# EAGLE design FrequencyGen (EAGLE 6.5.0)
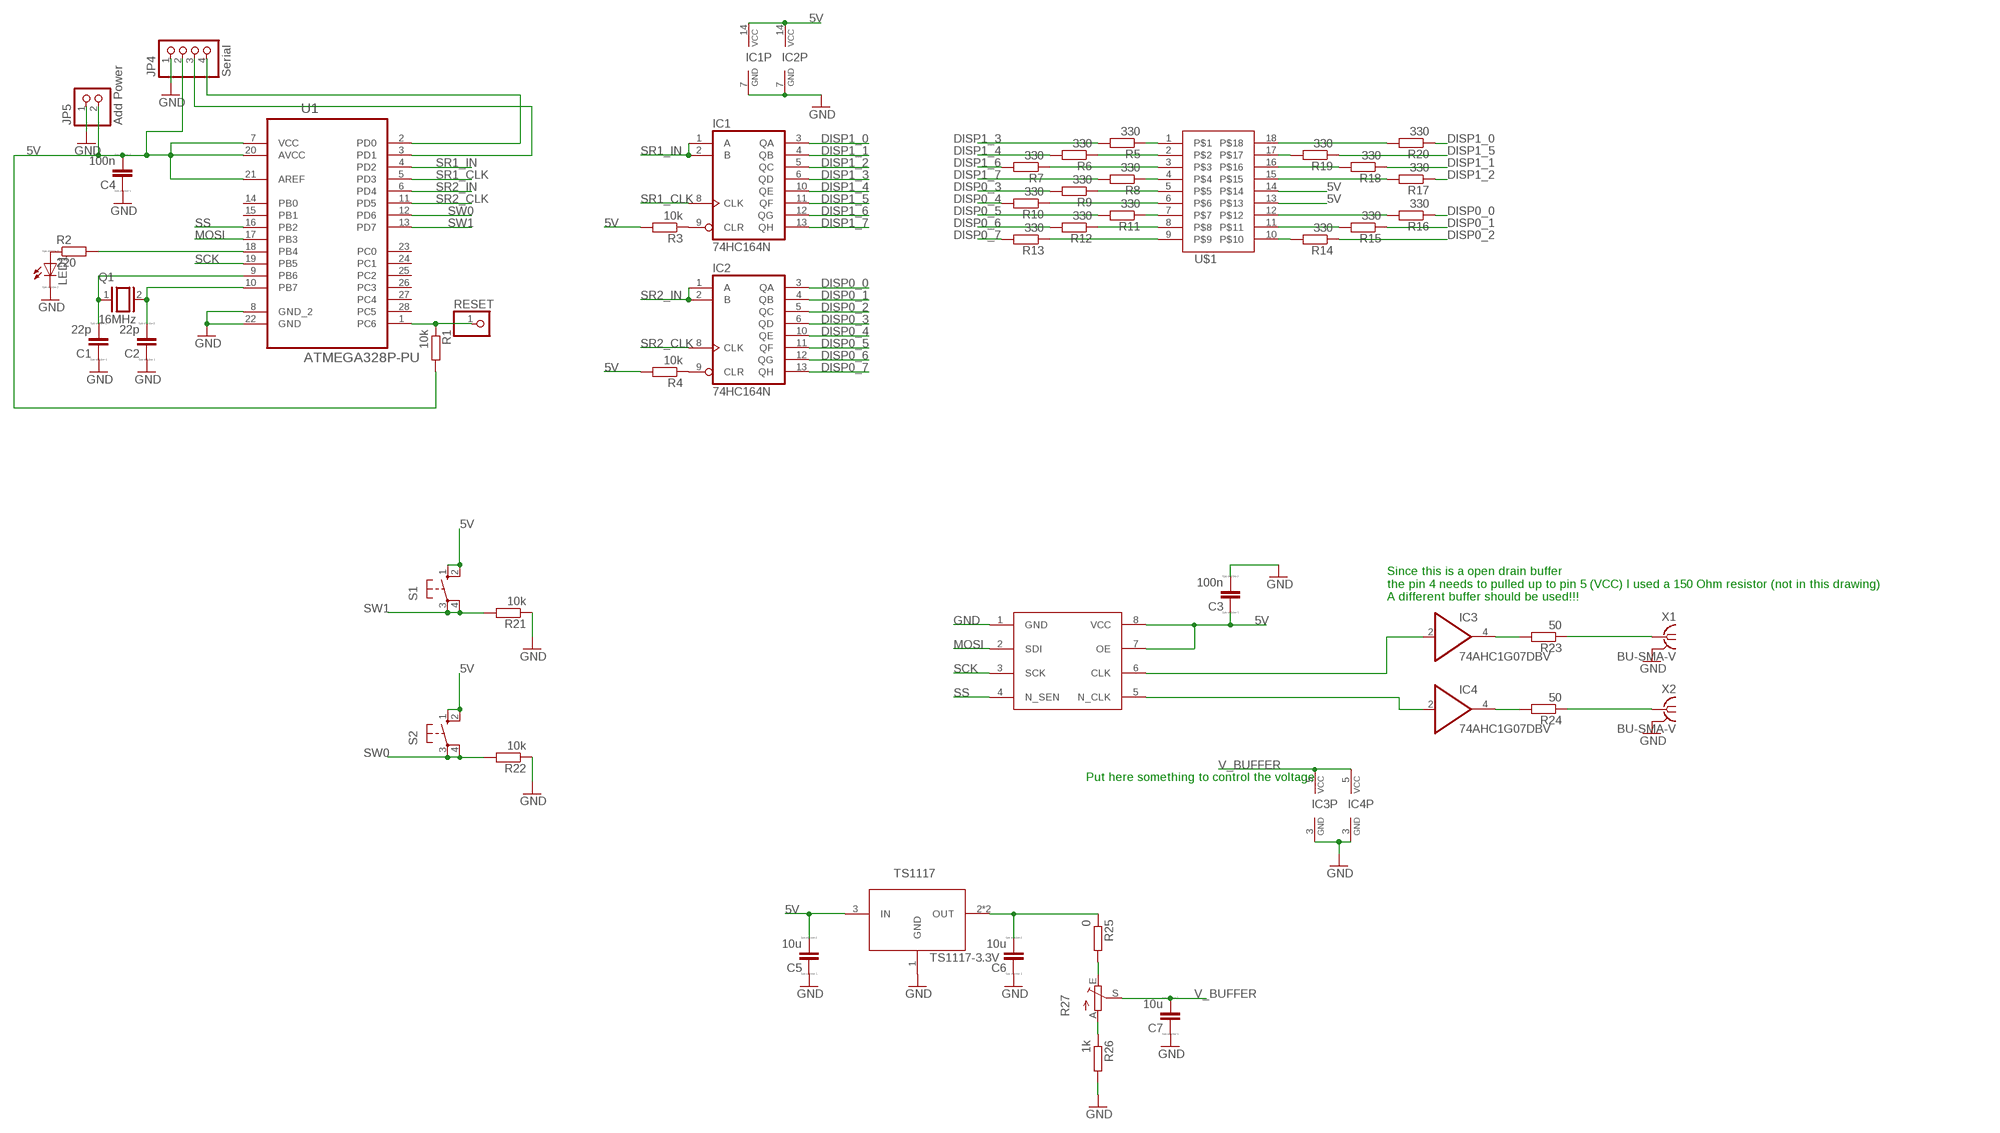
[diagram p0: schematic, sheet 1]

## Parts
C1  22p  C_SMD  [C0805]
C2  22p  C_SMD  [C0805]
C3  100n  C_SMD  [C0805]
C4  100n  C_SMD  [C0805]
C5  10u  C_SMD  [C0805]
C6  10u  C_SMD  [C0805]
C7  10u  C_SMD  [C0805]
IC1  74HC164N  [DIL14]
IC2  74HC164N  [DIL14]
IC3  74AHC1G07DBV  [SOT23-5]
IC4  74AHC1G07DBV  [SOT23-5]
JP4  Serial  PINHD-1X4  [1X04]
JP5  Add Power  PINHD-1X2  [1X02]
LED1  LED_ELD260  [LED_LD260]
Q1  16MHz  XTAL/S  [QS]
R1  10k  R-EU_R0805  [R0805]
R2  220  R-EU_R0805  [R0805]
R3  10k  R-EU_R0805  [R0805]
R4  10k  R-EU_R0805  [R0805]
R5  330  R-EU_R0805  [R0805]
R6  330  R-EU_R0805  [R0805]
R7  330  R-EU_R0805  [R0805]
R8  330  R-EU_R0805  [R0805]
R9  330  R-EU_R0805  [R0805]
R10  330  R-EU_R0805  [R0805]
R11  330  R-EU_R0805  [R0805]
R12  330  R-EU_R0805  [R0805]
R13  330  R-EU_R0805  [R0805]
R14  330  R-EU_R0805  [R0805]
R15  330  R-EU_R0805  [R0805]
R16  330  R-EU_R0805  [R0805]
R17  330  R-EU_R0805  [R0805]
R18  330  R-EU_R0805  [R0805]
R19  330  R-EU_R0805  [R0805]
R20  330  R-EU_R0805  [R0805]
R21  10k  R-EU_R0805  [R0805]
R22  10k  R-EU_R0805  [R0805]
R23  50  R-EU_R0805  [R0805]
R24  50  R-EU_R0805  [R0805]
R25  0  R-EU_R0805  [R0805]
R26  1k  R-EU_R0805  [R0805]
R27  TRIM_EU-CA6V  [CA6V]
RESET  PINHD-1X1  [1X01]
S1  10-XX  [B3F-10XX]
S2  10-XX  [B3F-10XX]
U1  ATMEGA328P-PU  [DIP254P762X457-28]
U$1  SEG_DISP_2X8  [DIL18-6]
U$2  LTC6903  [MSOP8]
U$3  TS1117-3.3V  TS1117  [SOT223]
X1  BU-SMA-V  [BU-SMA-V]
X2  BU-SMA-V  [BU-SMA-V]

## Nets
5V: C3.1 C4.2 C5.2 IC1.14(VCC) IC2.14(VCC) JP4.2 JP5.2 R1.2 R3.2 R4.2 S1.1(S) S1.2(S1) S2.1(S) S2.2(S1) U1.7(VCC) U1.20(AVCC) U1.21(AREF) U$1.13 U$1.14 U$2.7(OE) U$2.8(VCC) U$3.3(IN)
DISP0_0: IC2.3(QA) R16.1
DISP0_1: IC2.4(QB) R15.1
DISP0_2: IC2.5(QC) R14.1
DISP0_3: IC2.6(QD) R9.2
DISP0_4: IC2.10(QE) R10.2
DISP0_5: IC2.11(QF) R11.2
DISP0_6: IC2.12(QG) R12.2
DISP0_7: IC2.13(QH) R13.2
DISP1_0: IC1.3(QA) R20.1
DISP1_1: IC1.4(QB) R18.1
DISP1_2: IC1.5(QC) R17.1
DISP1_3: IC1.6(QD) R5.2
DISP1_4: IC1.10(QE) R6.2
DISP1_5: IC1.11(QF) R19.1
DISP1_6: IC1.12(QG) R7.2
DISP1_7: IC1.13(QH) R8.2
GND: C1.1 C2.1 C3.2 C4.1 C5.1 C6.1 C7.1 IC1.7(GND) IC2.7(GND) IC3.3(GND) IC4.3(GND) JP4.1 JP5.1 LED1.K(C) R21.1 R22.1 R26.2 U1.8(GND_2) U1.22(GND) U$2.1(GND) U$3.1(GND) X1.2 X1.3 X1.4 X1.5 X2.2 X2.3 X2.4 X2.5
MOSI: U1.17(PB3) U$2.2(SDI)
N$1: LED1.A R2.1
N$2: IC1.9(CLR) R3.1
N$3: IC2.9(CLR) R4.1
N$4: R5.1 U$1.1
N$5: R1.1 RESET.1 U1.1(PC6)
N$6: C1.2 Q1.1 U1.9(PB6)
N$7: C2.2 Q1.2 U1.10(PB7)
N$8: R6.1 U$1.2
N$9: R7.1 U$1.3
N$10: R8.1 U$1.4
N$11: R9.1 U$1.5
N$12: R10.1 U$1.6
N$13: R11.1 U$1.7
N$14: R12.1 U$1.8
N$15: R13.1 U$1.9
N$16: R20.2 U$1.18
N$17: R19.2 U$1.17
N$18: R18.2 U$1.16
N$19: R17.2 U$1.15
N$20: R16.2 U$1.12
N$21: R15.2 U$1.11
N$22: R14.2 U$1.10
N$23: R2.2 U1.18(PB4)
N$26: JP4.3 U1.3(PD1)
N$27: JP4.4 U1.2(PD0)
N$28: IC3.4(O) R23.2
N$29: IC4.4(O) R24.2
N$30: R23.1 X1.1
N$31: R24.1 X2.1
N$32: IC3.2(I) U$2.6(CLK)
N$33: IC4.2(I) U$2.5(N_CLK)
N$38: R25.2 R27.E
N$39: C6.2 R25.1 U$3.2(OUT) U$3.4(OUT)
N$40: R26.1 R27.A
SCK: U1.19(PB5) U$2.3(SCK)
SR1_CLK: IC1.8(CLK) U1.5(PD3)
SR1_IN: IC1.1(A) IC1.2(B) U1.4(PD2)
SR2_CLK: IC2.8(CLK) U1.11(PD5)
SR2_IN: IC2.1(A) IC2.2(B) U1.6(PD4)
SS: U1.16(PB2) U$2.4(N_SEN)
SW0: R22.2 S2.3(P) S2.4(P1) U1.12(PD6)
SW1: R21.2 S1.3(P) S1.4(P1) U1.13(PD7)
V_BUFFER: C7.2 IC3.5(VCC) IC4.5(VCC) R27.S
Unconnected: U1.14(PB0) U1.15(PB1) U1.23(PC0) U1.24(PC1) U1.25(PC2) U1.26(PC3) U1.27(PC4) U1.28(PC5)

## Notes on the sheet
- Since this is a open drain buffer
  the pin 4 needs to pulled up to pin 5 (VCC) I used a 150 Ohm resistor (not in this drawing)
  A different buffer should be used!!!
- Put here something to control the voltage

## Library data of the parts
C1-C7 = 0myLib:C_SMD: CAPACITOR, European symbol; SPICEMODEL: NONE; SPICEPREFIX: C
IC1 IC2 = 0myLib:74*164: 8-bit parallel out SHIFT REGISTER
IC3 IC4 = 0myLib:74*1G07: Single Buffer/Driver With Open-Drain Output
JP4 = 0myLib:PINHD-1X4: PIN HEADER
JP5 = 0myLib:PINHD-1X2: PIN HEADER
LED1 = 0myLib:LED_E: LED Source: http://www.osram.convergy.de Source: www.luxeon.com Source: www.kingbright.com; SPICEMODEL: NONE; SPICEPREFIX: D; SPICETYPE: diode
Q1 = 0myLib:XTAL/S: CRYSTAL
R1-R26 = 0myLib:R-EU_: RESISTOR, European symbol
R27 = 0myLib:TRIM_EU-: POTENTIOMETER
RESET = 0myLib:PINHD-1X1: PIN HEADER
S1 S2 = 0myLib:10-XX: OMRON SWITCH; MPN: B3F-1000; OC_FARNELL: 176432; OC_NEWARK: 36M3542
U1 = 0myLib:ATMEGA328P-PU: 8-bit Microcontroller with In-System Programmable Flash; MPN: ATMEGA328P-PU; OC_FARNELL: 1715487; OC_NEWARK: 15R0268; PACKAGE: PDIP-28; SUPPLIER: Atmel
U$1 = 0myLib:SEG_DISP_2X8
U$2 = 0myLib:LTC6903
U$3 = 0myLib:TS1117
X1 X2 = 0myLib:BU-SMA-V: FEMALE SMA CONNECTOR Radiall distributor RS 112-3794; OC_FARNELL: unknown; OC_NEWARK: unknown

## Board
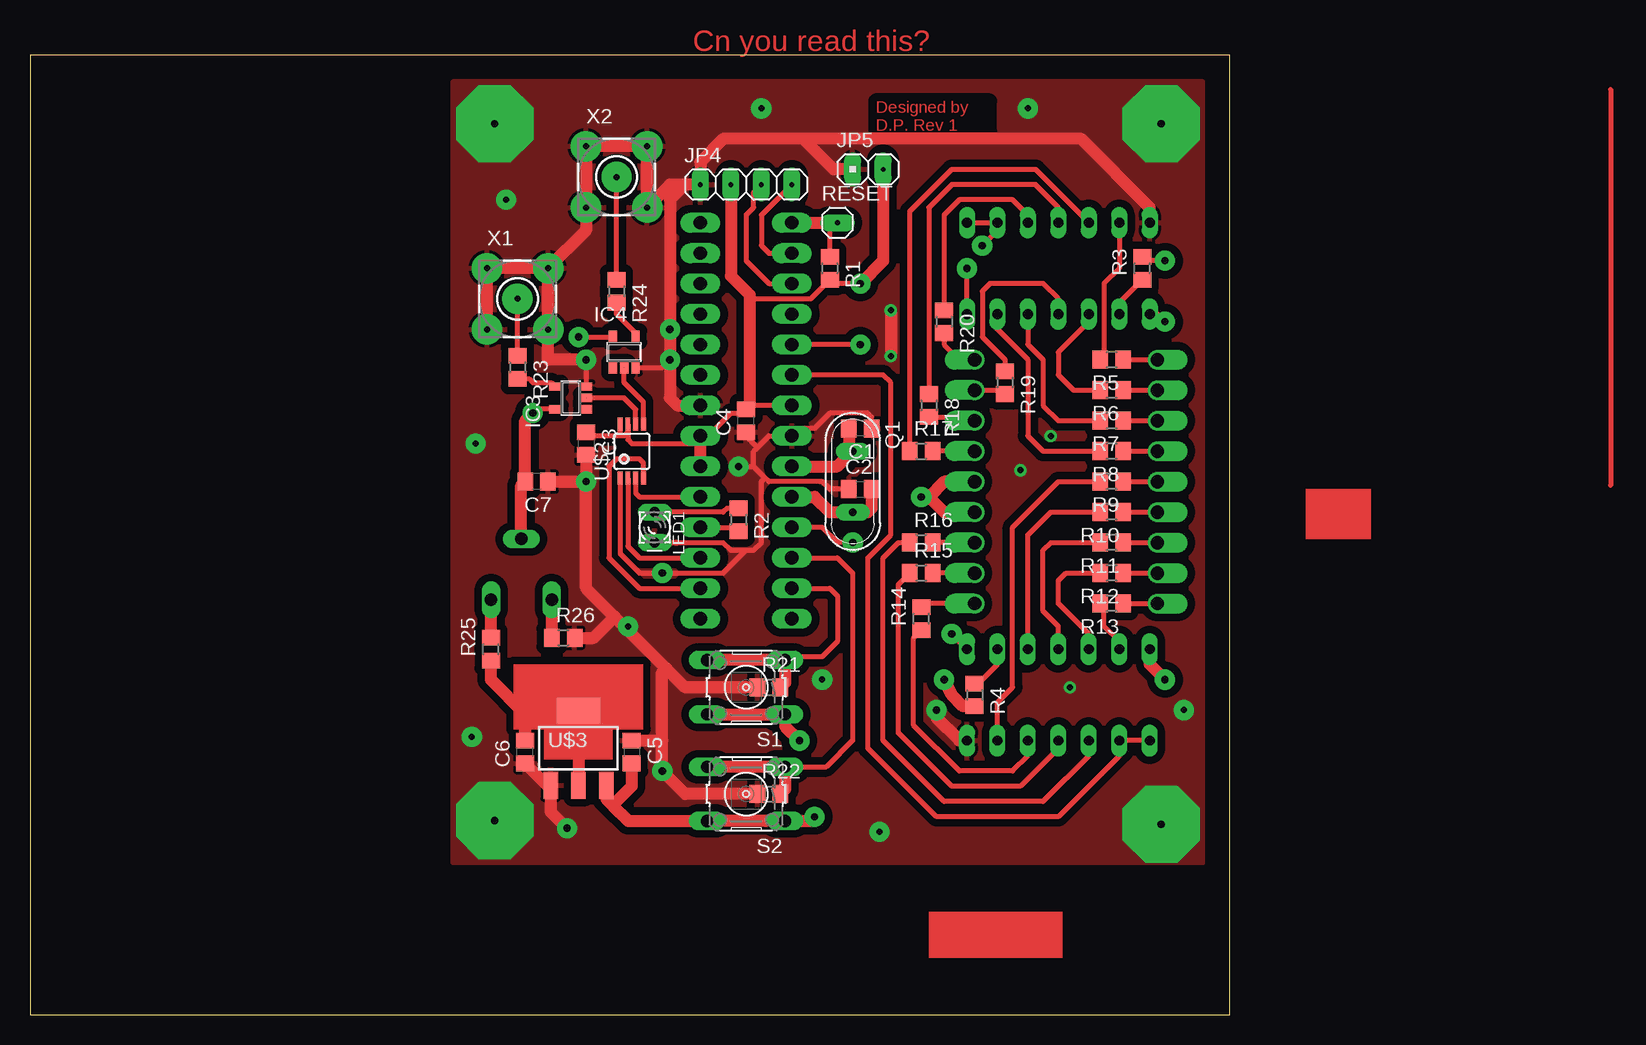
[diagram p1: board, top side]
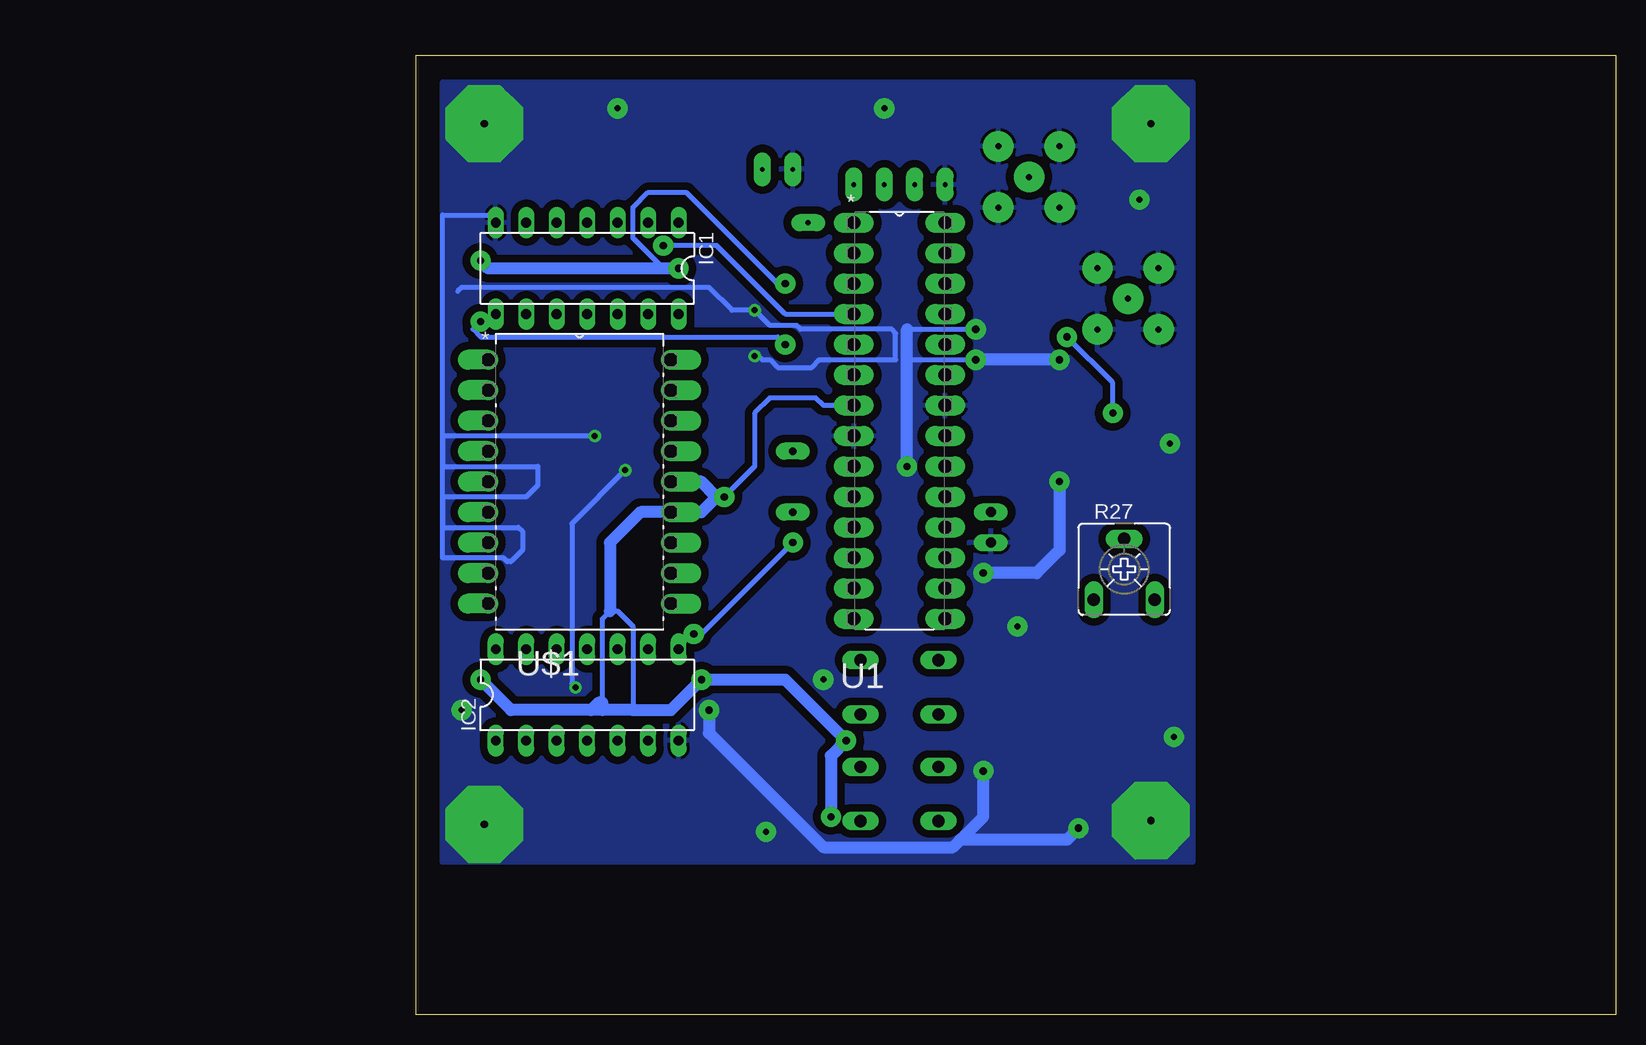
[diagram p2: board, bottom side, seen from below]

Size 100 x 80 mm. Coordinates in mm from the lower left corner, seen from the top.
Outline: 0,0 100,0 100,80 0,80 0,0
Copper layers (1*16): Top 0.035mm / dielectric 1.5mm / Bottom 0.035mm
Design rules "FinalizeAreaFill": minimum track width 12mil, minimum drill 1.4mm, track to track 25mil, track to pad 25mil, pad to pad 8mil, via to via 8mil, smd to smd 8mil, copper to edge 40mil, drill to drill 8mil, minimum pad ring 10mil, minimum via ring 8mil, stop-mask expansion 4mil, vias tented up to drill 0mil, thermal gap 10mil

### Footprints (pad centres in the part's own frame; a part is rotated, then mirrored left to right if it is on the bottom)
C0805 = smd 1.3 x 1.5: 1 -0.95,0; 2 0.95,0
DIL14 = drill 0.813 long: 1 -7.62,-3.81; 2 -5.08,-3.81; 3 -2.54,-3.81; 4 0,-3.81; 5 2.54,-3.81; 6 5.08,-3.81; 7 7.62,-3.81; 8 7.62,3.81; 9 5.08,3.81; 10 2.54,3.81; 11 0,3.81; 12 -2.54,3.81; 13 -5.08,3.81; 14 -7.62,3.81
SOT23-5 = smd 0.69 x 0.99: 1 -0.95,-1.29; 2 0,-1.29; 3 0.95,-1.29; 4 0.95,1.3; 5 -0.95,1.3
1X04 = drill 0.4 pad 1.422 long: 1 -3.81,0; 2 -1.27,0; 3 1.27,0; 4 3.81,0
1X02 = drill 0.4 pad 1.422 long: 1 -1.27,0; 2 1.27,0
LED_LD260 = drill 0.813 pad 1.422 long: A -1.27,0; K 1.27,0
QS = drill 0.61 pad 1.422 long: 1 -2.54,0; 2 2.54,0
R0805 = smd 1.3 x 1.5: 1 -0.95,0; 2 0.95,0
CA6V = drill 1.016 long: A -2.54,-2.54; E 2.54,-2.54; S 0,2.54
1X01 = drill 0.4 pad 1.422 long: 1 0,0
B3F-10XX = drill 1.016 long: 1 -3.251,2.261; 2 3.251,2.261; 3 -3.251,-2.261; 4 3.251,-2.261
DIP254P762X457-28 = drill 1.118 long: 1 -7.62,33.02; 2 -7.62,30.48; 3 -7.62,27.94; 4 -7.62,25.4; 5 -7.62,22.86; 6 -7.62,20.32; 7 -7.62,17.78; 8 -7.62,15.24; 9 -7.62,12.7; 10 -7.62,10.16; 11 -7.62,7.62; 12 -7.62,5.08; 13 -7.62,2.54; 14 -7.62,0; 15 0,0; 16 0,2.54; 17 0,5.08; 18 0,7.62; 19 0,10.16; 20 0,12.7; 21 0,15.24; 22 0,17.78; 23 0,20.32; 24 0,22.86; 25 0,25.4; 26 0,27.94; 27 0,30.48; 28 0,33.02
DIL18-6 = drill 1.118 offset: 1 -7.62,10.16; 2 -7.62,7.62; 3 -7.62,5.08; 4 -7.62,2.54; 5 -7.62,0; 6 -7.62,-2.54; 7 -7.62,-5.08; 8 -7.62,-7.62; 9 -7.62,-10.16; 10 7.62,-10.16; 11 7.62,-7.62; 12 7.62,-5.08; 13 7.62,-2.54; 14 7.62,0; 15 7.62,2.54; 16 7.62,5.08; 17 7.62,7.62; 18 7.62,10.16
MSOP8 = smd 0.4 x 1.1: 1 -0.975,-2.25; 2 -0.325,-2.25; 3 0.325,-2.25; 4 0.975,-2.25; 5 0.975,2.25; 6 0.325,2.25; 7 -0.325,2.25; 8 -0.975,2.25
SOT223 = smd 1.219 x 2.235: 1 -2.311,-3.099; 2 0,-3.099; 3 2.311,-3.099 | smd 3.6 x 2.2: 4 0,3.099
BU-SMA-V = drill 0.5 pad 2.54: 1 0,0; 2 -2.55,2.55; 3 2.55,2.55; 4 2.55,-2.55; 5 -2.55,-2.55

### Placement (x,y rotation side)
C1  69.22,48.9 180 top
C2  69.22,43.81 0 top
C3  46.35,47.62 270 top
C4  59.69,49.53 90 top
C5  50.16,21.91 270 top
C6  41.27,21.91 90 top
C7  42.23,44.45 180 top
IC1  85.72,62.23 180 bottom
IC2  85.72,26.67 0 bottom
IC3  45.09,51.44 90 top
IC4  49.53,55.24 0 top
JP4  59.69,69.22 0 top
JP5  69.85,70.48 0 top
LED1  52.07,40.64 270 top
Q1  68.58,44.45 270 top
R1  66.67,62.23 270 top
R2  59.05,41.27 270 top
R3  92.71,62.23 90 top
R4  78.74,26.67 270 top
R5  90.17,54.61 180 top
R6  90.17,52.07 180 top
R7  90.17,49.53 180 top
R8  90.17,46.99 180 top
R9  90.17,44.45 180 top
R10  90.17,41.91 180 top
R11  90.17,39.37 180 top
R12  90.17,36.83 180 top
R13  90.17,34.29 180 top
R14  74.3,33.02 90 top
R15  74.3,36.83 0 top
R16  74.3,39.37 0 top
R17  74.3,46.99 0 top
R18  74.93,50.8 270 top
R19  81.28,52.7 270 top
R20  76.2,57.78 270 top
R21  61.59,27.3 0 top
R22  61.59,18.41 0 top
R23  40.64,53.98 270 top
R24  48.9,60.33 270 top
R25  38.42,30.48 90 top
R26  44.45,31.43 0 top
R27  40.96,37.15 0 bottom
RESET  67.31,66.04 0 top
S1  59.69,27.3 180 top
S2  59.69,18.41 180 top
U1  55.88,33.02 0 bottom
U$1  86.36,44.45 0 bottom
U$2  50.16,46.99 0 top
U$3  45.72,22.23 0 top
X1  40.64,59.69 0 top
X2  48.9,69.85 0 top

### Tracks (layer width: path | path; a pad name or v marks a point on that pad's centre or on a via)
5V  (via drill 0.6 pad 1.68)
  Top 0.406: IC1.14 v78.11,62.23 | v94.61,62.87 93.03,62.87 R3.2 | 59.69,60.33 60.01,60.01 60.33,59.69 65.08,59.69 R1.2 67,60.96 v69.22,60.96 | U1.7 60.01,50.8 C4.2 59.38,50.16 58.42,50.16 56.52,48.26 U1.21 55.24,47.62 50.16,47.62 49.84,47.95 49.84,48.57 | U$2.8 49.19,48.55 48.9,48.26 | 48.9,48.26 46.67,48.26 C3.1 | U$2.7 49.84,48.57 | 49.84,48.57 49.53,48.26 48.9,48.26
  Top 1.016: IC2.14 93.34,29.21 v94.61,27.94 | JP4.2 58.42,61.59 59.69,60.33 | 60.01,50.8 60.01,60.01 | U1.20 U1.21 | v74.3,43.18 74.93,43.18 | 74.93,43.18 76.2,41.91 U$1.13 | U$1.14 76.2,44.45 74.93,43.18 | S2.1 S2.2 49.89,16.15 48.58,17.46 | S1.2 S1.1 62.94,24.05 v64.14,22.86 | S2.1 61.32,16.15 | S2.1 65.05,16.15 v65.41,16.51 | R4.2 77.78,25.72 76.83,26.67 v76.2,27.94 | U$3.3 48.03,18.01 48.58,17.46 | C5.2 50.16,19.05 48.58,17.46 | JP5.2 71.12,62.87 v69.22,60.96
  Bottom 0.406: 84.45,25.4 84.45,26.04 84.45,33.02 83.82,33.66 83.19,33.66 81.92,32.38 81.92,25.4 | U1.7 66.04,50.8 66.67,51.44 70.48,51.44 71.75,50.16 71.75,45.72 v74.3,43.18 | v78.11,62.23 79.38,62.23 81.92,64.77 81.92,67.31 80.64,68.58 77.47,68.58 69.85,60.96 v69.22,60.96
  Bottom 1.016: v78.11,62.23 93.98,62.23 v94.61,62.87 | 85.41,25.4 84.45,25.4 81.92,25.4 78.74,25.4 v76.2,27.94 69.22,27.94 v64.14,22.86 65.41,21.59 v65.41,16.51 | 85.41,25.4 92.08,25.4 v94.61,27.94 | 74.93,43.18 76.2,44.45 U$1.14 | 74.93,43.18 76.2,41.91 U$1.13 81.28,41.91 83.82,39.37 83.82,33.66 | 74.93,43.18 v74.3,43.18 | 84.45,26.04 84.77,26.04 85.41,25.4
DISP0_0
  Top 0.406: IC2.3 88.27,21.59 84.45,17.78 76.2,17.78 71.12,22.86 71.12,38.1 72.39,39.37 R16.1
DISP0_1
  Top 0.406: IC2.4 85.72,22.23 82.55,19.05 76.83,19.05 72.39,23.5 72.39,35.88 R15.1
DISP0_2
  Top 0.406: IC2.5 83.19,21.59 81.92,20.32 77.47,20.32 73.66,24.13 73.66,31.43 R14.1
DISP0_3
  Top 0.406: IC2.6 80.64,26.04 81.92,27.3 81.92,40.64 85.72,44.45 R9.2
DISP0_4
  Top 0.406: IC2.10 83.19,40.01 85.09,41.91 R10.2
DISP0_5
  Top 0.406: IC2.11 85.72,32.38 84.45,33.66 84.45,38.73 85.09,39.37 R11.2
DISP0_6
  Top 0.406: IC2.12 88.27,31.75 85.72,34.29 85.72,36.2 86.36,36.83 R12.2
DISP0_7
  Top 0.406: IC2.13 90.81,31.11 89.53,32.38 89.53,33.98 R13.2
DISP1_0
  Top 0.406: IC1.3 83.19,66.67 81.92,67.94 77.47,67.94 76.2,66.67 R20.1
DISP1_1
  Top 0.406: IC1.4 85.72,67.31 83.82,69.22 76.83,69.22 74.93,67.31 R18.1
DISP1_2
  Top 0.406: R17.1 73.34,67 76.83,70.48 83.82,70.48 IC1.5
DISP1_3
  Top 0.406: IC1.6 90.81,62.23 89.53,60.96 89.53,54.92 R5.2
DISP1_4
  Top 0.406: IC1.10 88.27,57.78 85.72,55.24 85.72,53.34 87,52.07 R6.2
DISP1_5
  Top 0.406: IC1.11 85.72,59.69 84.45,60.96 80.01,60.96 79.38,60.33 79.38,56.52 81.28,54.61 R19.1
DISP1_6
  Top 0.406: IC1.12 83.19,55.88 84.45,54.61 84.45,50.8 85.72,49.53 R7.2
DISP1_7
  Top 0.406: IC1.13 80.64,57.15 83.19,54.61 83.19,48.26 84.45,46.99 R8.2
GND  (via drill 0.5 pad 1.02, 0.5 pad 1.68, 0.6 pad 1.68, 0.6 pad 6.45)
  Top 0.406: C2.1 66.67,43.81 66.04,44.45 61.59,44.45 61.28,44.77 | 61.28,44.77 60.33,45.72 | C1.1 70.17,49.85 69.85,50.16 66.67,50.16 65.41,48.9 64.14,48.9 U1.8 61.59,48.26 60.64,47.31 | 60.33,45.72 60.33,46.99 60.64,47.31 | v59.05,45.72 60.33,45.72 | C4.1 59.69,48.26 60.64,47.31 | LED1.K 57.78,39.37 58.42,38.73 59.69,38.73 | 59.69,38.73 60.33,38.73 60.96,39.37 60.96,44.45 61.28,44.77 | U$2.1 49.19,38.44 50.8,36.83 v52.7,36.83 57.78,36.83 59.69,38.73 | IC4.3 52.69,53.95 v53.34,54.61 | IC3.3 46.38,54.59 v46.35,54.61
  Top 1.016: JP4.1 54.61,69.22 53.34,67.94 v53.34,57.15 v53.34,54.61 53.34,51.44 53.98,50.8 U1.22 | v46.35,54.61 43.18,54.61 X1.4 X1.3 | X1.5 X1.2 X1.3 | X2.4 X2.3 X2.2 X2.5 46.34,65.39 X1.3 | C3.2 v46.35,44.45 | R21.1 54.61,27.3 53.02,28.89 | 53.02,28.89 48.74,33.18 | 48.74,33.18 46.35,35.56 v46.35,44.45 | R22.1 54.61,18.41 v52.7,20.32 52.7,22.86 | 52.7,22.86 52.7,28.57 53.02,28.89 | IC2.7 77.47,22.86 75.56,24.77 v75.56,25.4 | IC1.7 93.34,67.31 87.63,73.03 64.45,73.03 | 64.45,73.03 57.78,73.03 55.88,71.12 JP4.1 | JP4.1 53.34,69.22 X2.4 | C6.1 43.11,19.13 U$3.1 43.41,16.92 v44.77,15.56 | R26.2 46.99,31.43 48.74,33.18 | C5.1 52.7,22.86 | C7.1 v46.35,44.45 | JP5.1 66.99,70.48 64.45,73.03 | v71.75,58.74 v71.75,54.93
  Bottom 0.406: 59.05,57.15 v53.34,57.15 | 59.05,54.61 v53.34,54.61 | v82.55,45.4 87,40.96 87,27.62 v86.68,27.3 | v85.09,48.26 97.79,48.26 97.79,45.72 89.85,45.72 89.85,44.13 90.81,43.18 97.79,43.18 97.79,40.64 91.44,40.64 91.12,40.32 91.12,38.73 92.08,37.78 92.39,37.78 92.71,38.1 97.79,38.1 97.79,66.67 93.98,66.67 93.03,65.72 | v71.75,54.93 71.44,54.93 71.12,54.61 70.48,54.61 69.85,53.98 66.99,53.98 66.36,54.61 60.01,54.61 60.01,56.83 60.33,57.15 67.94,57.15 68.26,57.47 70.48,57.47 v71.75,58.74 73.66,58.74 75.56,60.64 96.2,60.64 96.52,60.33
  Bottom 1.016: v59.05,45.72 59.05,54.61 59.05,57.15 | v46.35,54.61 v53.34,54.61 | v46.35,44.45 46.35,38.73 48.26,36.83 v52.7,36.83 | v75.56,25.4 75.56,23.5 66.04,13.97 55.24,13.97 54.61,14.61 | 54.61,14.61 52.7,16.51 v52.7,20.32 | v44.77,15.56 45.72,14.61 54.61,14.61
  other vias: 38.73,74.3 94.3,74.3 94.3,15.88 38.73,16.19 66.04,27.94 49.85,32.38 36.83,23.18 37.15,47.62 39.69,67.94 60.96,75.56 83.19,75.56 70.8,15.24 96.2,25.4
  pour Top: 35.24,77.79 35.24,12.7 97.79,12.7 97.79,77.79
  pour Bottom: 35.24,77.79 35.24,12.7 97.79,12.7 97.79,77.79
MOSI
  Top 0.406: U$2.2 49.84,39.06 50.8,38.1 U1.17
N$1
  Top 0.406: R2.1 58.1,42.23 57.78,41.91 LED1.A
N$2
  Top 0.406: IC1.9 90.81,59.38 R3.1
N$3
  Top 0.406: IC2.9 80.64,29.21 79.38,27.94 79.06,27.94 R4.1
N$4
  Top 0.406: R5.1 U$1.1
N$5
  Top 0.406: R1.1 66.67,66.04
  Top 1.016: U1.1 66.67,66.04 RESET.1
N$6
  Top 1.016: U1.9 67.31,45.72 Q1.1 68.27,47.3 C1.2
N$7
  Top 1.016: U1.10 65.41,43.18 66.67,41.91 Q1.2 69.85,41.91 70.17,42.23 C2.2
N$8
  Top 0.406: R6.1 U$1.2
N$9
  Top 0.406: R7.1 U$1.3
N$10
  Top 0.406: R8.1 U$1.4
N$11
  Top 0.406: R9.1 U$1.5
N$12
  Top 0.406: R10.1 U$1.6
N$13
  Top 0.406: R11.1 U$1.7
N$14
  Top 0.406: R12.1 U$1.8
N$15
  Top 0.406: R13.1 U$1.9
N$16
  Top 0.406: R20.2 76.2,55.88 77.47,54.61 U$1.18
N$17
  Top 0.406: U$1.17 80.97,52.07 R19.2
N$18
  Top 0.406: R18.2 78.42,49.85 U$1.16
N$19
  Top 0.406: U$1.15 R17.2
N$20
  Top 0.406: U$1.12 R16.2
N$21
  Top 0.406: U$1.11 R15.2
N$22
  Top 0.406: U$1.10 74.61,34.29 R14.2
N$23
  Top 0.406: U1.18 58.74,40.64 R2.2
N$24
  Top 0.406: 131.76,77.15 131.76,44.13
N$26
  Top 0.406: U1.3 61.59,60.96 59.69,62.87 59.69,66.67 60.33,67.31 60.33,68.58 JP4.3
N$27
  Top 0.406: U1.2 61.59,63.5 60.96,64.14 60.96,66.67 JP4.4
N$28
  Top 0.406: R23.2 41.59,53.02 41.91,52.7 43.47,52.7 IC3.4
N$29
  Top 0.406: IC4.4 50.48,56.84 48.9,58.42 R24.2
N$30
  Top 0.406: R23.1 X1.1
N$31
  Top 0.406: R24.1 X2.1
N$32
  Top 0.406: U$2.6 50.49,50.48 49.53,51.44 IC3.2
N$33
  Top 0.406: U$2.5 51.14,51.09 49.53,52.7 IC4.2
N$38
  Top 1.016: R25.2 R27.E
N$39
  Top 1.016: U$3.2 U$3.4 42.47,25.32 41.27,24.13 C6.2 41.27,25.08 38.42,27.94 R25.1
N$40
  Top 1.016: R27.A R26.1
SCK
  Top 0.406: U$2.3 50.49,43.49 50.8,43.18 U1.19
SR1_CLK  (via drill 0.6 pad 1.68)
  Top 0.406: IC1.8 93.98,58.42 v94.61,57.78 | v69.22,55.88 U1.5
  Bottom 0.406: v94.61,57.78 95.25,57.15 94.61,56.52 69.85,56.52 v69.22,55.88
SR1_IN  (via drill 0.6 pad 1.68)
  Top 0.406: IC1.1 IC1.2 80.64,65.41 v79.38,64.14
  Bottom 0.406: v79.38,64.14 74.93,64.14 69.22,58.42 U1.4
SR2_CLK  (via drill 0.6 pad 1.68)
  Top 0.406: IC2.8 v76.83,31.75 | v68.58,39.37 67.31,39.37 66.04,40.64 U1.11
  Bottom 0.406: 76.83,31.11 v76.83,31.75 76.2,31.75 v68.58,39.37
SR2_IN
  Top 0.406: IC2.1 IC2.2 90.81,21.59 85.72,16.51 75.56,16.51 69.85,22.23 69.85,38.1 71.75,40.01 71.75,52.7 71.12,53.34 U1.6
SS
  Top 0.406: U$2.4 51.14,46.02 50.8,46.35 48.9,46.35 48.26,45.72 48.26,38.1 50.8,35.56 U1.16
SW0
  Top 0.406: U1.12 67.31,38.1 68.58,36.83 68.58,22.86 66.4,20.68 S2.3
  Top 1.016: R22.2 62.94,18.81 S2.3 S2.4
SW1
  Top 0.406: U1.13 66.67,35.56 67.31,34.92 67.31,31.11 66.04,29.84 63.22,29.84 S1.3
  Top 1.016: R21.2 62.94,27.7 S1.3 S1.4
V_BUFFER  (via drill 0.6 pad 1.68)
  Top 0.406: IC3.5 42.23,50.48 v41.91,50.16 | v45.72,56.52 48.55,56.52 IC4.5
  Top 1.016: R27.S 40.96,44.13 C7.2 41.28,49.53 v41.91,50.16
  Bottom 0.406: v41.91,50.16 41.91,52.7 v45.72,56.52
(copper drawn outside any net)
  shapes: Top area x4

### Text on the board
Top: Cn you read this? | Designed by / D.P. Rev 1